# EAGLE design timer-LED (EAGLE 6.5.0)
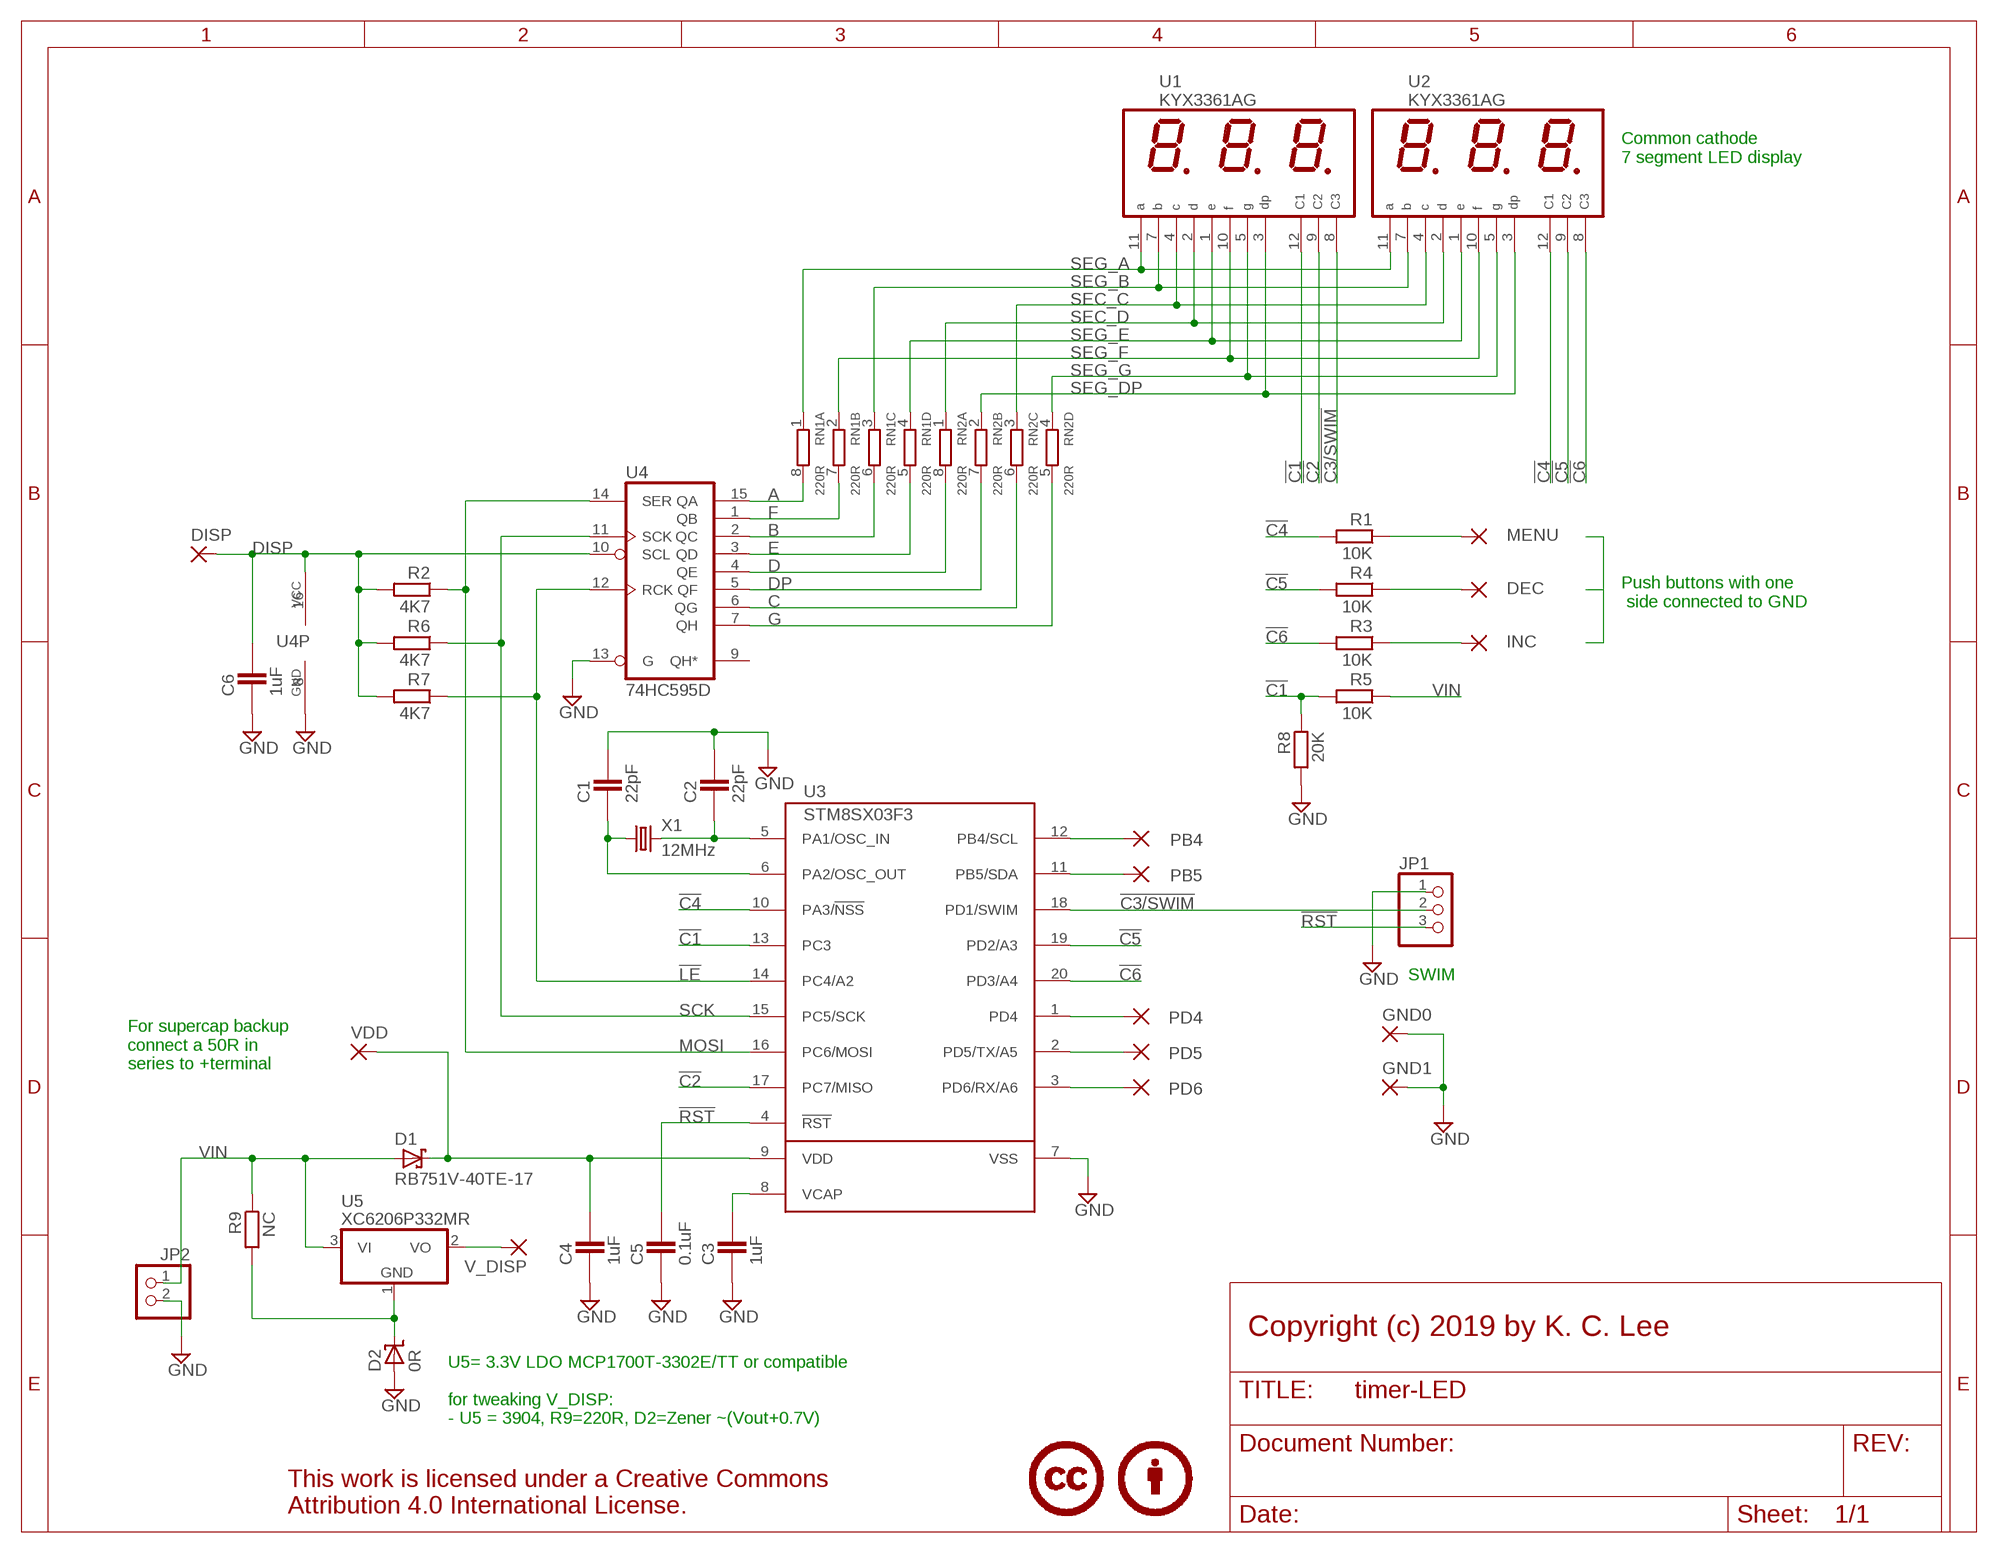
[diagram p0: schematic, sheet 1]

## Parts
C1  22pF  CAPACITOR_0603  [CAPC1608X92N]
C2  22pF  CAPACITOR_0603  [CAPC1608X92N]
C3  1uF  CAPACITOR_0603  [CAPC1608X92N]
C4  1uF  CAPACITOR_0603  [CAPC1608X92N]
C5  0.1uF  CAPACITOR_0603  [CAPC1608X92N]
C6  1uF  CAPACITOR_0805N  [CAP2012X70N]
D1  RB751V-40TE-17  SCHOTTKY_SOD-323  [SOD2514X100N]
D2  0R  ZENER_SOD-323  [SOD2514X100N]
DEC  SMD2  [SMD1,27-2,54]
DISP  SMD2  [SMD1,27-2,54]
GND0  SMD2  [SMD1,27-2,54]
GND1  SMD2  [SMD1,27-2,54]
INC  SMD2  [SMD1,27-2,54]
JP1  PINHD-1X3  [1X03]
JP2  PINHD-1X2_2.54  [1X02]
LICENSE1  CC-BY75%  [CC-BY-75]
MENU  SMD2  [SMD1,27-2,54]
PB4  SMD2  [SMD1,27-2,54]
PB5  SMD2  [SMD1,27-2,54]
PD4  SMD2  [SMD1,27-2,54]
PD5  SMD2  [SMD1,27-2,54]
PD6  SMD2  [SMD1,27-2,54]
R1  10K  RESISTOR_0603  [RESC1608X55N]
R2  4K7  RESISTOR_0603  [RESC1608X55N]
R3  10K  RESISTOR_0805  [RESC2012X70N]
R4  10K  RESISTOR_0805  [RESC2012X70N]
R5  10K  RESISTOR_0603  [RESC1608X55N]
R6  4K7  RESISTOR_0603  [RESC1608X55N]
R7  4K7  RESISTOR_0603  [RESC1608X55N]
R8  20K  RESISTOR_0603  [RESC1608X55N]
R9  NC  RESISTOR_0603  [RESC1608X55N]
RN1  220R  4R-NCAT16  [CAT16]
RN2  220R  4R-NCAT16  [CAT16]
U1  KYX3361AG  DISP-3CC  [KYX3361]
U2  KYX3361AG  DISP-3CC  [KYX3361]
U3  STM8SX03F3  [TSSOP20]
U4  74HC595D  74LS595D  [SO16]
U5  XC6206P332MR  MCP1700/TT  [SOT95P280X135-3N]
V_DISP  SMD2  [SMD1,27-2,54]
VDD  SMD2  [SMD1,27-2,54]
X1  12MHz  CRYSTALHC49U-V  [HC49U-V]

## Nets
!C1: R5.2 R8.1 U1.12(C1) U3.13(PC3)
!C2: U1.9(C2) U3.17(PC7/MISO)
!C3/SWIM: JP1.2 U1.8(C3) U3.18(PD1/SWIM)
!C4: R1.2 U2.12(C1) U3.10(PA3/!NSS)
!C5: R4.2 U2.9(C2) U3.19(PD2/A3)
!C6: R3.2 U2.8(C3) U3.20(PD3/A4)
!LE: R7.1 U3.14(PC4/A2) U4.12(RCK)
!RST: C5.2 JP1.3 U3.4(!RST)
A: RN1.8 U4.15(QA)
B: RN1.6 U4.2(QC)
C: RN2.6 U4.6(QG)
D: RN2.8 U4.4(QE)
DISP: C6.2 DISP.1(P) R2.2 R6.2 R7.2 U4.10(SCL) U4.16(VCC)
DP: RN2.7 U4.5(QF)
E: RN1.5 U4.3(QD)
F: RN1.7 U4.1(QB)
G: RN2.5 U4.7(QH)
GND: C1.2 C2.2 C3.1 C4.1 C5.1 C6.1 D2.A GND0.1(P) GND1.1(P) JP1.1 JP2.2 R8.2 U3.7(VSS) U4.8(GND) U4.13(G)
MOSI: R2.1 U3.16(PC6/MOSI) U4.14(SER)
N$1: DEC.1(P) R4.1
N$2: PB4.1(P) U3.12(PB4/SCL)
N$3: PB5.1(P) U3.11(PB5/SDA)
N$4: PD5.1(P) U3.2(PD5/TX/A5)
N$5: PD6.1(P) U3.3(PD6/RX/A6)
N$6: PD4.1(P) U3.1(PD4)
N$7: INC.1(P) R3.1
N$9: U5.2(VO) V_DISP.1(P)
N$10: C1.1 U3.6(PA2/OSC_OUT) X1.1
N$11: D2.K R9.2 U5.1(GND)
N$12: C2.1 U3.5(PA1/OSC_IN) X1.2
N$13: C3.2 U3.8(VCAP)
N$15: MENU.1(P) R1.1
SCK: R6.1 U3.15(PC5/SCK) U4.11(SCK)
SEC_C: RN2.3 U1.4(C) U2.4(C)
SEC_D: RN2.1 U1.2(D) U2.2(D)
SEG_A: RN1.1 U1.11(A) U2.11(A)
SEG_B: RN1.3 U1.7(B) U2.7(B)
SEG_DP: RN2.2 U1.3(DP) U2.3(DP)
SEG_E: RN1.4 U1.1(E) U2.1(E)
SEG_F: RN1.2 U1.10(F) U2.10(F)
SEG_G: RN2.4 U1.5(G) U2.5(G)
VDD: C4.2 D1.K U3.9(VDD) VDD.1(P)
VIN: D1.A JP2.1 R5.1 R9.1 U5.3(VI)
Unconnected: U4.9(QH*)

## Notes on the sheet
- Common cathode 
  7 segment LED display
- Push buttons with one
   side connected to GND
- SWIM
- For supercap backup
  connect a 50R in 
  series to +terminal
- Copyright (c) 2019 by K. C. Lee
- U5= 3.3V LDO MCP1700T-3302E/TT or compatible 
  
  for tweaking V_DISP:
  - U5 = 3904, R9=220R, D2=Zener ~(Vout+0.7V)

## Library data of the parts
C1-C6 = ipc-7351-capacitor:CAPACITOR_
D1 = ipc-7351-diode:SCHOTTKY_
D2 = ipc-7351-diode:ZENER_
DEC DISP GND0 GND1 INC MENU PB4 PB5 PD4-PD6 V_DISP VDD = wirepad:SMD2: SMD PAD
JP1 = Misc Conn:PINHD-1X3: PIN HEADER
JP2 = Misc Conn:PINHD-1X2: PIN HEADER
LICENSE1 = Misc logo:CC-BY
R1-R9 = ipc-7351-resistor:RESISTOR_
RN1 RN2 = Misc Passives:4R-N: Array Chip Resistor Source: RS Component / Phycomp; OC_FARNELL: unknown; OC_NEWARK: unknown
U1 U2 = Misc opto:DISP-3CC
U3 = Misc Processor:STM8SX03F
U4 = 74xx-us:74*595: 8-bit SHIFT REGISTER, output latch
U5 = Misc Power:MCP1700
X1 = crystal:CRYSTAL: CRYSTAL; OC_FARNELL: 1666969; OC_NEWARK: unknown

## Board
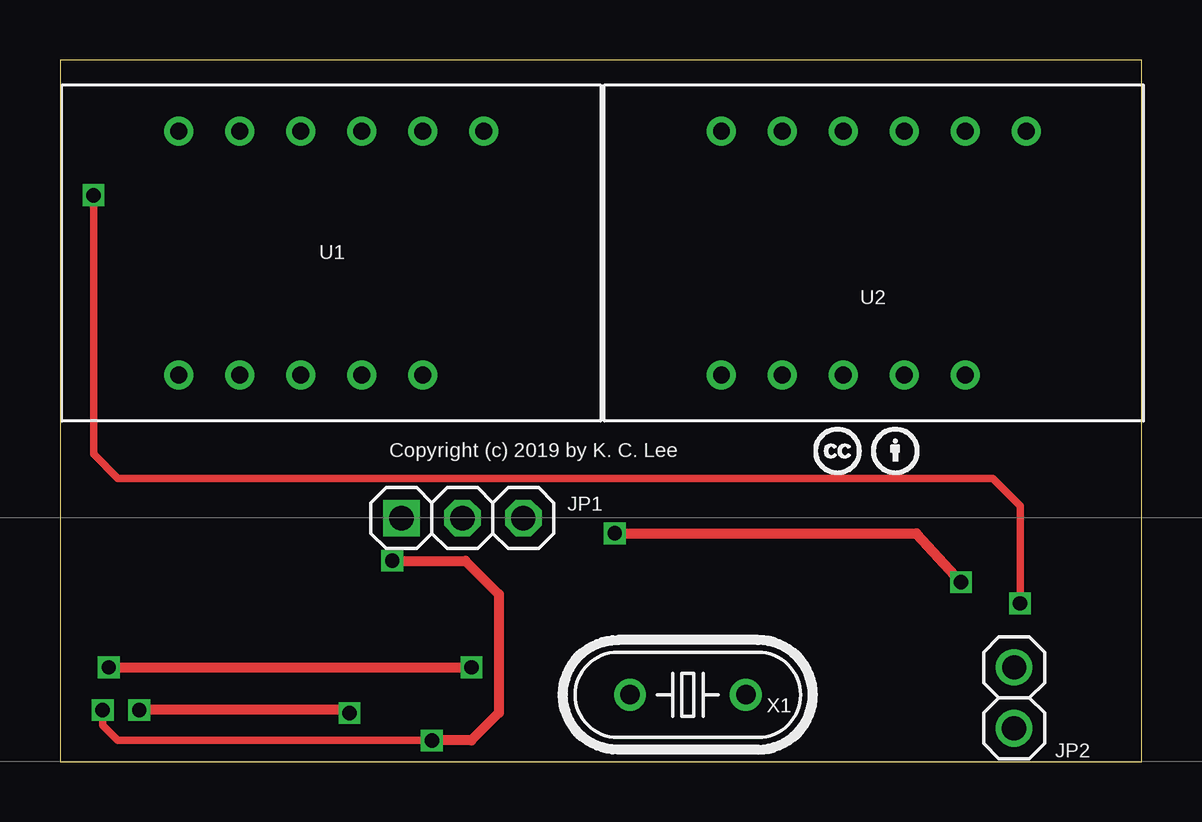
[diagram p1: board, top side]
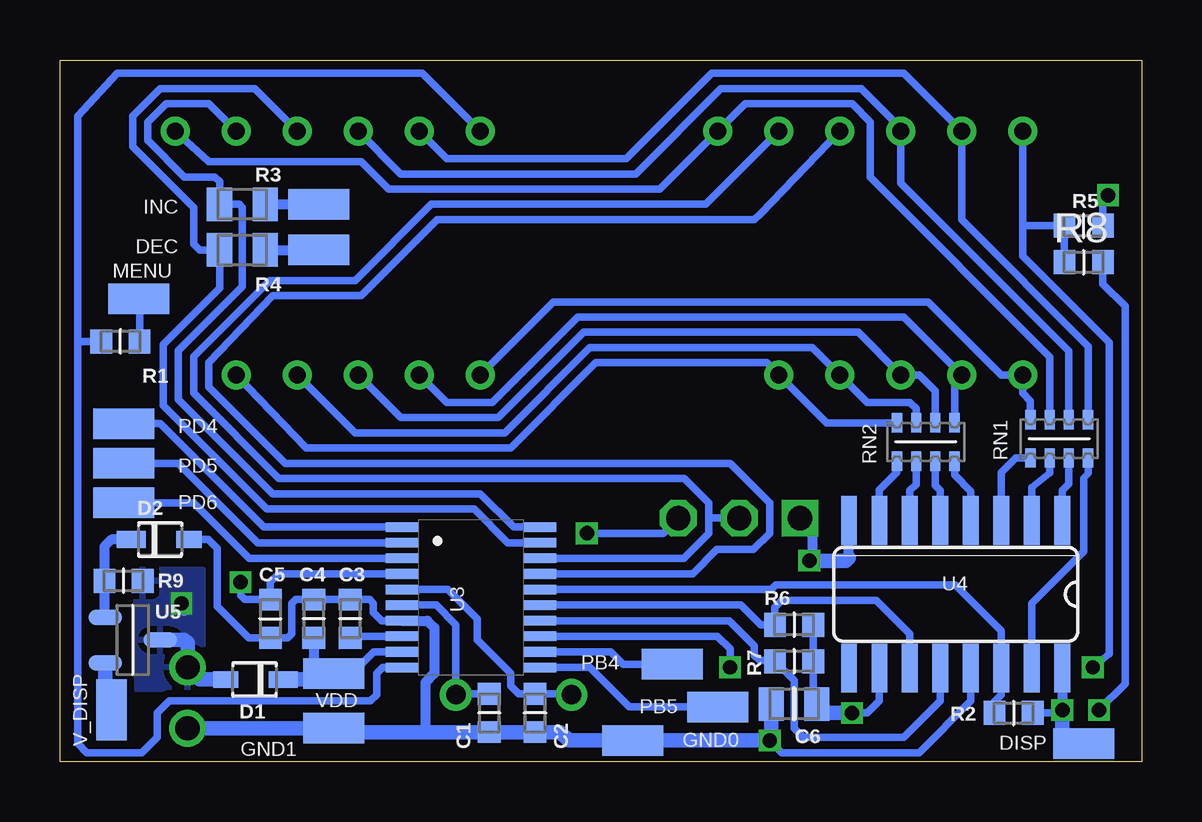
[diagram p2: board, bottom side, seen from below]

Size 45.06 x 29.26 mm. Coordinates in mm from the lower left corner, seen from the top.
Outline: 0,0 45.06,0 45.06,29.26 0,29.26 0,0
Copper layers (1*16): Top 0.035mm / dielectric 1.5mm / Bottom 0.035mm
Design rules "Elecrow 2-layer eagle rule": minimum track width 6mil, minimum drill 12mil, track to track 6mil, track to pad 6mil, pad to pad 6mil, via to via 6mil, smd to smd 0mil, copper to edge 10mil, drill to drill 10mil, minimum pad ring 10mil, minimum via ring 6mil, stop-mask expansion 2mil, vias tented up to drill 100mil, thermal gap 10mil

### Footprints (pad centres in the part's own frame; a part is rotated, then mirrored left to right if it is on the bottom)
CAPC1608X92N = smd 0.9 x 0.95: 1 -0.8,0; 2 0.8,0
CAP2012X70N = smd 1.05 x 1.4: 1 -0.95,0; 2 0.95,0
SOD2514X100N = smd 1.05 x 0.7: A 1.2,0 | smd 1.2 x 0.7: K -1.2,0
SMD1,27-2,54 = smd 1.27 x 2.54: 1 0,0
1X03 = drill 1.016 square: 1 -2.54,0 | drill 1.016 octagon: 2 0,0; 3 2.54,0
1X02 = drill 1: 1 -1.27,0 | drill 1.016: 2 1.27,0
RESC1608X55N = smd 0.9 x 1: 1 -0.8,0; 2 0.8,0
RESC2012X70N = smd 1.05 x 1.4: 1 -0.95,0; 2 0.95,0
CAT16 = smd 0.425 x 0.8: 1 -1.2,-0.8; 2 -0.4,-0.8; 3 0.4,-0.8; 4 1.2,-0.8; 5 1.2,0.8; 6 0.4,0.8; 7 -0.4,0.8; 8 -1.2,0.8
KYX3361 = drill 0.7: 1 -6.35,-5.08; 2 -3.81,-5.08; 3 -1.27,-5.08; 4 1.27,-5.08; 5 3.81,-5.08; 7 6.35,5.08; 8 3.81,5.08; 9 1.27,5.08; 10 -1.27,5.08; 11 -3.81,5.08; 12 -6.35,5.08
TSSOP20 = smd 0.4 x 1.35: 1 -2.925,-2.875; 2 -2.275,-2.875; 3 -1.625,-2.875; 4 -0.975,-2.875; 5 -0.325,-2.875; 6 0.325,-2.875; 7 0.975,-2.875; 8 1.625,-2.875; 9 2.275,-2.875; 10 2.925,-2.875; 11 2.925,2.875; 12 2.275,2.875; 13 1.625,2.875; 14 0.975,2.875; 15 0.325,2.875; 16 -0.325,2.875; 17 -0.975,2.875; 18 -1.625,2.875; 19 -2.275,2.875; 20 -2.925,2.875
SO16 = smd 0.66 x 2.032: 1 -4.445,-3.073; 2 -3.175,-3.073; 3 -1.905,-3.073; 4 -0.635,-3.073; 5 0.635,-3.073; 6 1.905,-3.073; 7 3.175,-3.073; 8 4.445,-3.073; 9 4.445,3.073; 10 3.175,3.073; 11 1.905,3.073; 12 0.635,3.073; 13 -0.635,3.073; 14 -1.905,3.073; 15 -3.175,3.073; 16 -4.445,3.073
SOT95P280X135-3N = smd 1.4 x 0.65: 1 -1.15,0.95; 2 -1.15,-0.95; 3 1.15,0
HC49U-V = drill 0.813: 1 -2.413,0; 2 2.413,0

### Placement (x,y rotation side)
C1  27.18,2.03 270 bottom
C2  25.27,2.03 270 bottom
C3  32.97,5.97 270 bottom
C4  34.49,5.97 270 bottom
C5  36.3,5.97 90 bottom
C6  14.48,2.41 0 bottom
D1  36.96,3.43 180 bottom
D2  40.89,9.27 0 bottom
DEC  34.29,21.34 90 bottom
DISP  2.41,0.76 90 bottom
GND0  21.21,0.89 90 bottom
GND1  33.66,1.4 90 bottom
INC  34.29,23.24 90 bottom
JP1  16.76,10.16 0 top
JP2  39.75,2.67 270 top
LICENSE1  31.37,11.94 0 top
MENU  41.78,19.3 270 bottom
PB4  19.56,4.06 270 bottom
PB5  17.65,2.29 90 bottom
PD4  42.42,14.1 90 bottom
PD5  42.42,12.45 90 bottom
PD6  42.42,10.8 90 bottom
R1  42.55,17.53 180 bottom
R2  5.33,2.03 0 bottom
R3  37.47,23.24 180 bottom
R4  37.47,21.34 180 bottom
R5  2.41,22.35 180 bottom
R6  14.48,5.71 0 bottom
R7  14.48,4.19 0 bottom
R8  2.41,20.83 0 bottom
R9  42.42,7.54 180 bottom
RN1  3.43,13.46 180 bottom
RN2  8.99,13.34 180 bottom
U1  11.3,21.21 0 top
U2  33.91,21.21 0 top
U3  27.94,6.86 270 bottom
U4  7.75,6.99 180 bottom
U5  42.04,5.08 0 bottom
V_DISP  42.93,2.16 180 bottom
VDD  33.66,3.68 90 bottom
X1  26.16,2.79 180 top

### Tracks (layer width: path | path; a pad name or v marks a point on that pad's centre or on a via)
!C1  (via drill 0.6)
  Top 0.406: v2.03,3.94 v17.14,3.94
  Bottom 0.305: U1.12 4.95,22.35 | 4.95,22.35 4.95,21.08 1.35,17.48 1.35,4.5 v2.03,3.94 | v17.14,3.94 17.14,4.7 17.68,5.23 U3.13 | 4.95,22.35 R5.2 R8.1
!C2
  Bottom 0.305: U1.9 15.88,22.86 16.13,22.61 29.34,22.61 32.51,19.43 36.2,19.43 38.86,16.64 38.86,15.62 35.69,12.45 17.14,12.45 15.49,10.8 15.49,9.52 16.17,8.85 17.69,8.85 18.71,7.83 U3.17
!C3/SWIM
  Bottom 0.305: U1.8 18.16,23.24 29.59,23.24 32.77,20.07 36.32,20.07 39.5,16.89 39.5,15.37 35.94,11.81 19.05,11.81 18.03,10.8 18.03,10.16 | JP1.2 18.03,10.16 | 18.03,10.16 18.03,9.52 19.08,8.48 U3.18
!C4
  Bottom 0.305: U2.12 29.97,28.7 42.67,28.7 44.32,26.92 44.32,17.4 | U3.10 31.63,3.93 31.88,3.68 31.88,2.79 32.13,2.54 40.51,2.54 41.02,2.03 41.02,1.02 41.66,0.38 43.94,0.38 44.32,0.76 44.32,17.4 | R1.2 44.2,17.53 44.32,17.4
!C5
  Bottom 0.305: U2.9 36.96,28.07 40.89,28.07 42.04,26.92 42.04,25.65 39.5,23.11 39.5,21.59 39.24,21.34 R4.2 38.41,19.75 40.77,17.4 40.77,14.86 36.45,10.54 27.81,10.54 26.41,9.13 U3.19
!C6
  Bottom 0.305: U2.8 38.86,27.43 40.64,27.43 41.4,26.67 41.4,25.91 39.88,24.38 38.61,24.38 38.41,24.19 R3.2 37.59,23.24 37.47,23.11 37.47,19.81 40.13,17.14 40.13,15.11 36.2,11.18 27.56,11.18 26.17,9.78 U3.20
!LE
  Bottom 0.305: U3.14 17.19,5.88 16.13,4.83 16.13,4.45 15.91,4.23 15.28,4.23 R7.1 14.48,3.39 14.48,1.4 14.1,1.02 9.91,1.02 8.38,2.54 U4.12
!RST  (via drill 0.6)
  Top 0.406: v23.11,9.52 35.69,9.52 v37.54,7.49
  Bottom 0.305: U3.4 35.96,7.83 36.3,7.49 C5.2 | JP1.3 19.94,9.52 v23.11,9.52 | 36.61,6.6 C5.2 | C5.2 37.38,6.77 37.54,6.93 v37.54,7.49
A
  Bottom 0.305: RN1.8 2.23,12.05 2.41,11.81 2.41,8.76 4.57,6.6 U4.15
B
  Bottom 0.305: RN1.6 3.83,12.05 4.57,11.43 U4.2
C
  Bottom 0.305: RN2.6 9.39,11.56 9.65,11.3 U4.6
D
  Bottom 0.305: RN2.8 7.79,11.96 7.11,11.28 U4.4
DISP  (via drill 0.6)
  Top 0.406: v12.06,2.03 11.94,2.16 v3.3,2.16
  Bottom 0.305: U4.10 10.92,2.54 11.43,2.03 v12.06,2.03 | R2.2 3.43,2.03 v3.3,2.16 | C6.2 13.68,2.56 R7.2 R6.2
  Bottom 0.406: U4.16 v3.3,2.16
  Bottom 0.61: C6.2 13.46,2.16 13.34,2.03 v12.06,2.03 | v3.3,2.16 3.3,1.14 3.05,0.89 DISP.1
DP
  Bottom 0.305: RN2.7 8.59,11.51 8.38,11.3 U4.5
E
  Bottom 0.305: U4.3 5.84,12.07 5.25,12.66 RN1.5
F
  Bottom 0.305: RN1.7 3.03,11.59 3.3,11.3 U4.1
G
  Bottom 0.305: RN2.5 10.19,12.06 10.92,11.33 U4.7
GND  (via drill 0.6)
  Top 0.305: v1.78,2.16 1.78,1.52 2.41,0.89 v15.49,0.89
  Top 0.406: v13.84,8.38 16.89,8.38 18.29,6.99 18.29,2.03 17.14,0.89 v15.49,0.89
  Bottom 0.305: U3.7 31.66,5.88 32,6.22 32,6.6 32.17,6.77 C3.1 C4.1 35.24,6.77 35.41,6.6 35.41,5.33 35.57,5.17 C5.1 37.2,5.17 38.51,6.48 38.51,8.89 38.89,9.27 D2.A | U4.13 7.11,2.54 9.27,0.38 14.99,0.38 v15.49,0.89 | R8.2 1.61,19.93 0.69,19 0.69,3.25 v1.78,2.16
  Bottom 0.406: U3.7 29.76,5.88 29.46,5.59 29.46,3.68 29.84,3.3 29.84,1.23 | 33.69,1.23 GND1.1 | 12.19,8.51 U4.8 | 15.75,0.89 v15.49,0.89 | JP1.1 13.72,9.78 13.72,8.76 v13.84,8.38
  Bottom 0.61: 33.69,1.23 29.84,1.23 C1.2 C2.2 24.22,1.23 23.88,0.89 GND0.1 15.75,0.89 | JP2.2 GND1.1 | v13.84,8.38 12.32,8.38 12.19,8.51 | C6.1 15.43,0.96 v15.49,0.89
MOSI
  Bottom 0.305: U3.16 15.44,7.18 15.24,7.38 7.77,7.38 5.84,5.46 U4.14 5.84,2.79 6.13,2.5 R2.1
N$1
  Bottom 0.406: R4.1 DEC.1
N$2
  Bottom 0.305: U3.12 22.11,4.58 21.59,4.06 PB4.1
N$3
  Bottom 0.305: U3.11 22.98,3.93 21.34,2.29 PB5.1
N$4
  Bottom 0.305: U3.2 36.82,9.13 40.13,12.45 PD5.1
N$5
  Bottom 0.305: U3.3 37.19,8.48 39.5,10.8 PD6.1
N$6
  Bottom 0.305: U3.1 36.58,9.78 40.89,14.1 PD4.1
N$7
  Bottom 0.406: R3.1 INC.1
N$9
  Bottom 0.61: 43.06,2.42 V_DISP.1 43.19,2.42 U5.2
N$10
  Bottom 0.305: U3.6 29.39,6.53 28.57,5.71 X1.1 28.54,2.83 C1.1
N$11
  Bottom 0.406: D2.K 42.93,9.27 43.22,8.98 R9.2 43.22,6.06 U5.1
N$12
  Bottom 0.305: U3.5 28.9,7.18 27.69,5.97 27.69,5.08 26.29,3.68 26.29,3.17 25.95,2.83 C2.1 23.79,2.83 X1.2
N$13
  Bottom 0.305: U3.8 32.96,5.23 C3.2
N$15
  Bottom 0.305: MENU.1 41.74,19.34 R1.1
SCK
  Bottom 0.305: U3.15 16.69,6.53 15.88,5.71 R6.1 15.28,6.44 14.99,6.73 11.05,6.73 9.65,5.33 U4.11
SEC_C
  Bottom 0.305: U2.4 32.77,13.72 26.54,13.72 22.99,17.27 13.72,17.27 U1.4 11.43,14.99 9.65,14.99 9.39,14.73 RN2.3
SEC_D
  Bottom 0.305: U2.2 28.96,14.99 27.05,14.99 23.5,18.54 9.91,18.54 U1.2 7.79,15.92 RN2.1
SEG_A
  Bottom 0.305: U2.11 28.96,25.15 21.46,25.15 17.91,28.7 9.91,28.7 U1.11 7.49,22.61 2.23,17.32 RN1.1
SEG_B
  Bottom 0.305: U2.7 38.86,25.02 32.51,25.02 31.37,23.88 20.07,23.88 U1.7 16.51,27.43 12.06,27.43 11.3,26.67 11.3,24.38 3.83,16.89 RN1.3
SEG_DP
  Bottom 0.305: U2.3 30.86,14.35 26.8,14.35 23.24,17.91 11.81,17.91 U1.3 9.27,16.13 8.59,15.45 RN2.2
SEG_E
  Bottom 0.305: U2.1 24.51,19.18 8.89,19.18 5.84,16.13 U1.1 4.95,15.37 4.63,15.04 RN1.4
SEG_F
  Bottom 0.305: U2.10 30.86,24.51 21.08,24.51 17.53,28.07 11.68,28.07 10.03,26.42 U1.10 10.03,24.13 3.03,17.13 RN1.2
SEG_G
  Bottom 0.305: U2.5 34.8,13.08 26.29,13.08 22.73,16.64 15.62,16.64 U1.5 13.12,14.14 RN2.4
VDD
  Bottom 0.305: U3.9 31.99,4.58 32.89,3.68
  Bottom 0.406: 32.89,3.68 VDD.1 34.29,3.68 34.49,4.01 C4.2
  Bottom 0.61: D1.K 33.78,3.43 VDD.1
VIN  (via drill 0.6)
  Top 0.305: v1.4,23.62 1.4,12.83 2.41,11.81 38.86,11.81 40.01,10.67 v40.01,6.6
  Bottom 0.305: R5.1 1.61,23.41 v1.4,23.62 | v40.01,6.6 40.01,6.35 39.88,6.22
  Bottom 0.61: D1.A 39.24,3.43 JP2.1 39.75,4.95 39.88,5.08 U5.3
  pour Bottom (isolate 0.305): 39.12,8 41.91,8 41.91,3.05 39.12,3.05

### Text on the board
tPlace: Copyright (c) 2019 by K. C. Lee